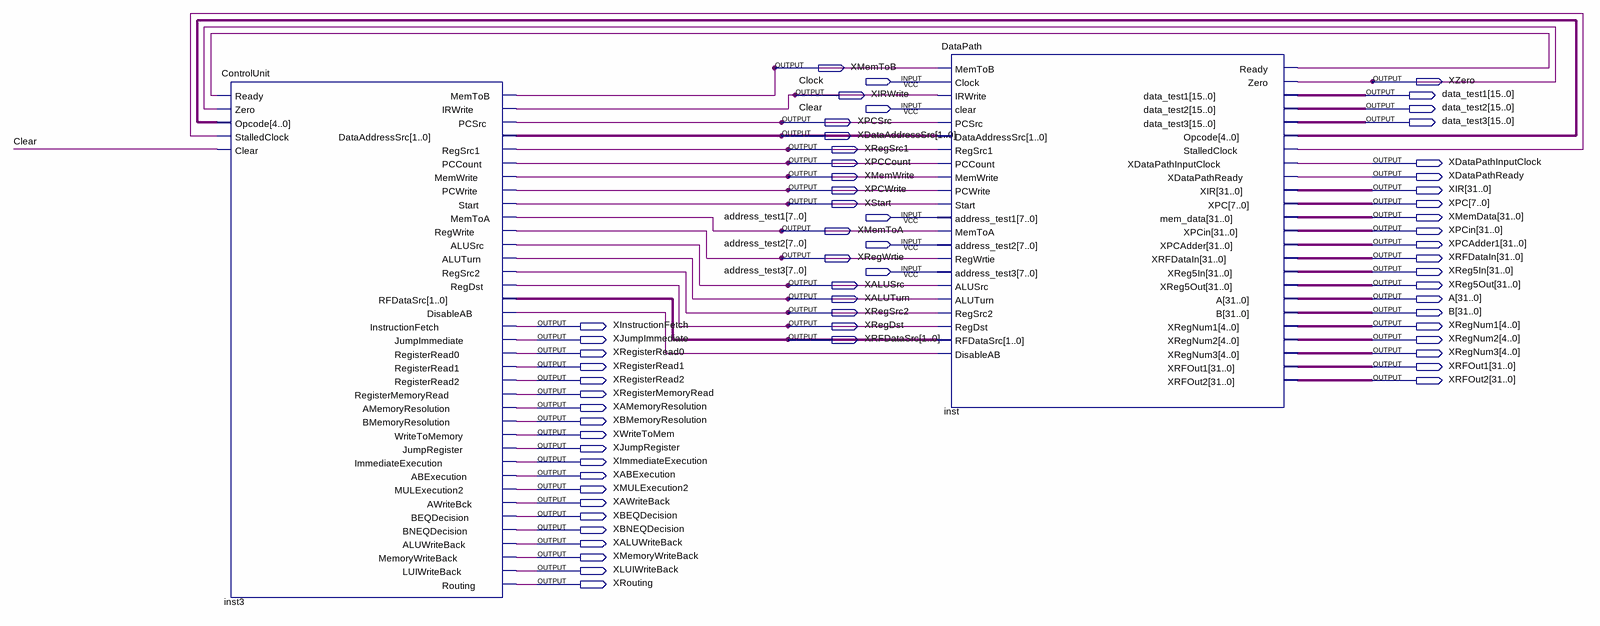
[diagram p0: schematic sheet]
// Quartus schematic CPU.bdf as structural Verilog: 2 symbols, 62 pins
module CPU (
  input  Clock,
  input  Clear,
  input  [7:0] address_test1,
  input  [7:0] address_test2,
  input  [7:0] address_test3,
  output XMemToB,
  output XZero,
  output XIRWrite,
  output [15:0] data_test1,
  output [15:0] data_test2,
  output XPCSrc,
  output [15:0] data_test3,
  output [1:0] XDataAddressSrc,
  output XRegSrc1,
  output XPCCount,
  output XDataPathInputClock,
  output XMemWrite,
  output XDataPathReady,
  output XPCWrite,
  output [31:0] XIR,
  output XStart,
  output [7:0] XPC,
  output [31:0] XMemData,
  output XMemToA,
  output [31:0] XPCin,
  output [31:0] XPCAdder1,
  output XRegWrtie,
  output [31:0] XRFDataIn,
  output [31:0] XReg5In,
  output XALUSrc,
  output [31:0] XReg5Out,
  output XALUTurn,
  output [31:0] A,
  output XRegSrc2,
  output [31:0] B,
  output XInstructionFetch,
  output XRegDst,
  output [4:0] XRegNum1,
  output XJumpImmediate,
  output [1:0] XRFDataSrc,
  output [4:0] XRegNum2,
  output XRegisterRead0,
  output [4:0] XRegNum3,
  output XRegisterRead1,
  output [31:0] XRFOut1,
  output XRegisterRead2,
  output [31:0] XRFOut2,
  output XRegisterMemoryRead,
  output XAMemoryResolution,
  output XBMemoryResolution,
  output XWriteToMem,
  output XJumpRegister,
  output XImmediateExecution,
  output XABExecution,
  output XMULExecution2,
  output XAWriteBack,
  output XBEQDecision,
  output XBNEQDecision,
  output XALUWriteBack,
  output XMemoryWriteBack,
  output XLUIWriteBack,
  output XRouting
);

  wire inst3_disableab, inst_ready, inst_stalledclock;
  wire [4:0] inst_opcode;

  ControlUnit inst3 (
    .Ready(inst_ready), .Zero(XZero), .Opcode(inst_opcode), .StalledClock(inst_stalledclock), .Clear(Clear),
    .MemToB(XMemToB), .IRWrite(XIRWrite), .PCSrc(XPCSrc), .DataAddressSrc(XDataAddressSrc),
    .RegSrc1(XRegSrc1), .PCCount(XPCCount), .MemWrite(XMemWrite), .PCWrite(XPCWrite), .Start(XStart),
    .MemToA(XMemToA), .RegWrite(XRegWrtie), .ALUSrc(XALUSrc), .ALUTurn(XALUTurn), .RegSrc2(XRegSrc2),
    .RegDst(XRegDst), .RFDataSrc(XRFDataSrc), .DisableAB(inst3_disableab),
    .InstructionFetch(XInstructionFetch), .JumpImmediate(XJumpImmediate), .RegisterRead0(XRegisterRead0),
    .RegisterRead1(XRegisterRead1), .RegisterRead2(XRegisterRead2), .RegisterMemoryRead(XRegisterMemoryRead),
    .AMemoryResolution(XAMemoryResolution), .BMemoryResolution(XBMemoryResolution),
    .WriteToMemory(XWriteToMem), .JumpRegister(XJumpRegister), .ImmediateExecution(XImmediateExecution),
    .ABExecution(XABExecution), .MULExecution2(XMULExecution2), .AWriteBck(XAWriteBack),
    .BEQDecision(XBEQDecision), .BNEQDecision(XBNEQDecision), .ALUWriteBack(XALUWriteBack),
    .MemoryWriteBack(XMemoryWriteBack), .LUIWriteBack(XLUIWriteBack), .Routing(XRouting));
  DataPath inst (
    .MemToB(XMemToB), .Clock(Clock), .IRWrite(XIRWrite), .clear(Clear), .PCSrc(XPCSrc),
    .DataAddressSrc(XDataAddressSrc), .RegSrc1(XRegSrc1), .PCCount(XPCCount), .MemWrite(XMemWrite),
    .PCWrite(XPCWrite), .Start(XStart), .address_test1(address_test1), .MemToA(XMemToA),
    .address_test2(address_test2), .RegWrtie(XRegWrtie), .address_test3(address_test3), .ALUSrc(XALUSrc),
    .ALUTurn(XALUTurn), .RegSrc2(XRegSrc2), .RegDst(XRegDst), .RFDataSrc(XRFDataSrc),
    .DisableAB(inst3_disableab), .Ready(inst_ready), .Zero(XZero), .data_test1(data_test1),
    .data_test2(data_test2), .data_test3(data_test3), .Opcode(inst_opcode), .StalledClock(inst_stalledclock),
    .XDataPathInputClock(XDataPathInputClock), .XDataPathReady(XDataPathReady), .XIR(XIR), .XPC(XPC),
    .mem_data(XMemData), .XPCin(XPCin), .XPCAdder(XPCAdder1), .XRFDataIn(XRFDataIn), .XReg5In(XReg5In),
    .XReg5Out(XReg5Out), .A(A), .B(B), .XRegNum1(XRegNum1), .XRegNum2(XRegNum2), .XRegNum3(XRegNum3),
    .XRFOut1(XRFOut1), .XRFOut2(XRFOut2));
endmodule
